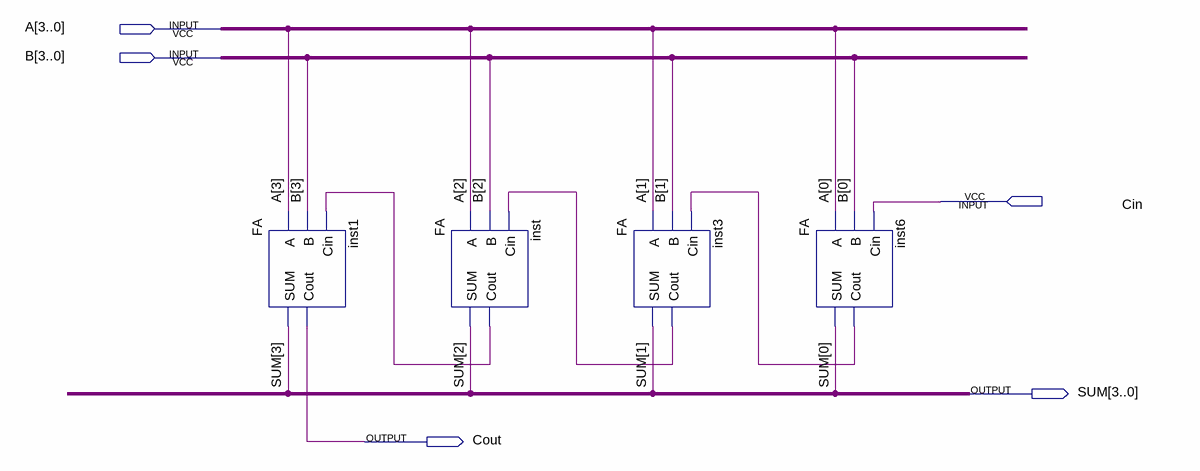
[diagram p0: schematic sheet]
// Quartus schematic FA4bit.bdf as structural Verilog: 4 symbols, 5 pins
module FA4bit (
  input  [3:0] A,
  input  [3:0] B,
  input  Cin,
  output [3:0] SUM,
  output Cout
);

  wire inst3_cout, inst6_cout, inst_cout;

  FA inst1 (.A(A[3]), .B(B[3]), .Cin(inst_cout), .SUM(SUM[3]), .Cout(Cout));
  FA inst (.A(A[2]), .B(B[2]), .Cin(inst3_cout), .SUM(SUM[2]), .Cout(inst_cout));
  FA inst3 (.A(A[1]), .B(B[1]), .Cin(inst6_cout), .SUM(SUM[1]), .Cout(inst3_cout));
  FA inst6 (.A(A[0]), .B(B[0]), .Cin(Cin), .SUM(SUM[0]), .Cout(inst6_cout));
endmodule
